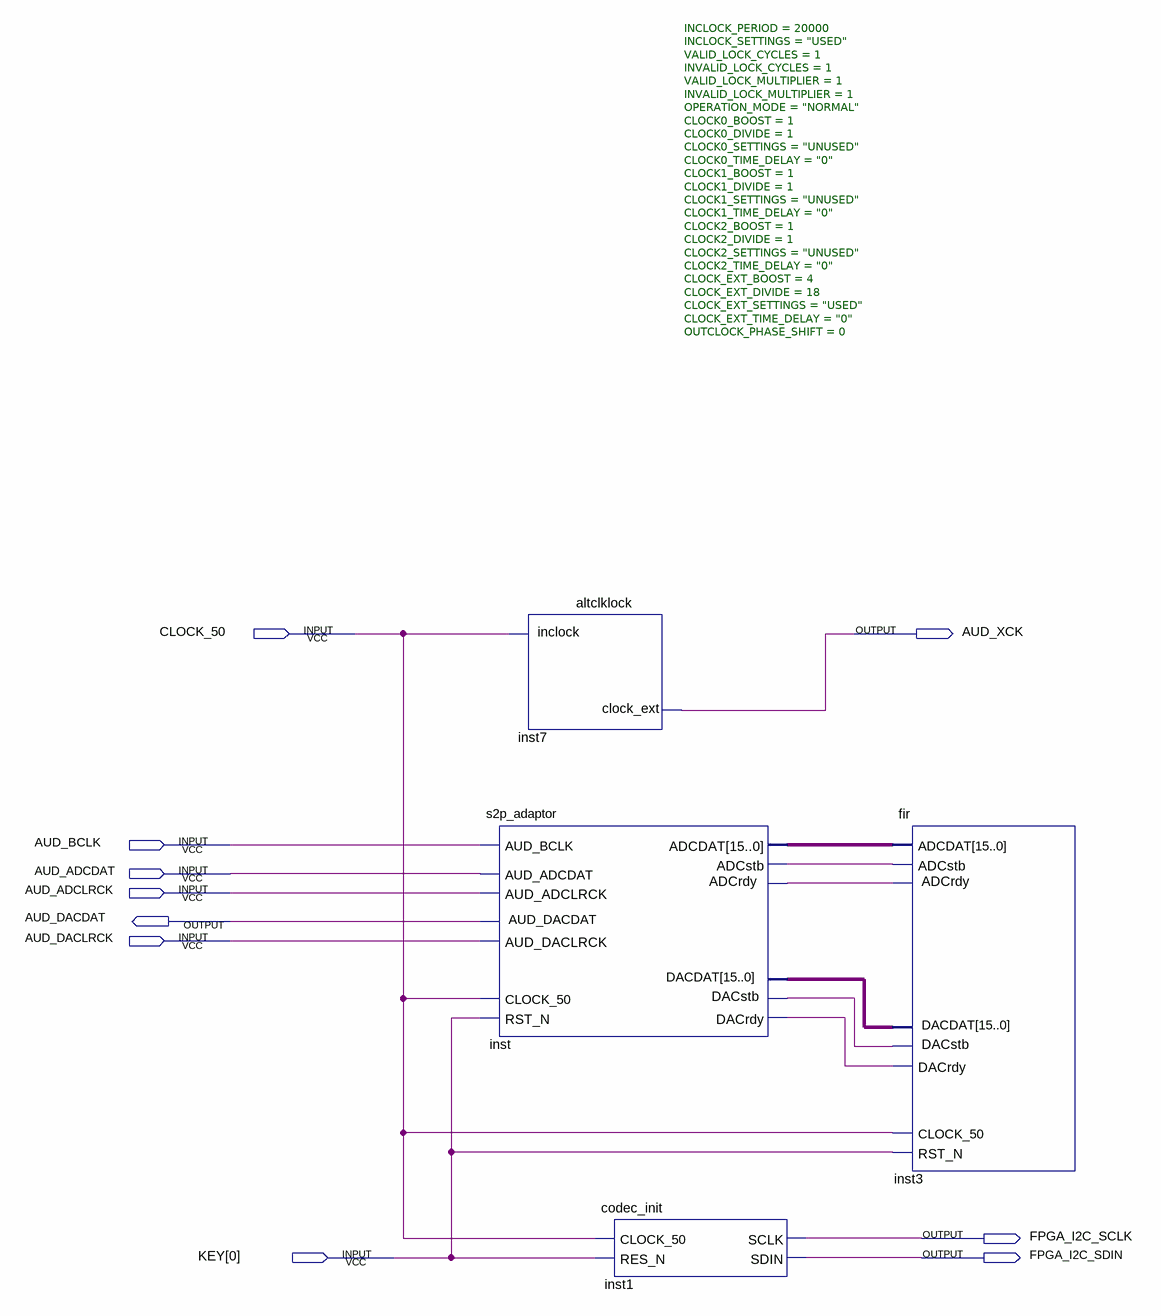
[diagram p0: schematic sheet]
// Quartus schematic audio_processor.bdf as structural Verilog: 4 symbols, 10 pins
module audio_processor (
  input  CLOCK_50,
  input  AUD_BCLK,
  input  AUD_ADCDAT,
  input  AUD_ADCLRCK,
  input  AUD_DACLRCK,
  input  [0:0] KEY,
  output AUD_XCK,
  output AUD_DACDAT,
  output FPGA_I2C_SCLK,
  output FPGA_I2C_SDIN
);

  wire inst3_adcrdy, inst3_dacstb, inst_adcstb, inst_dacrdy;
  wire [15:0] inst3_dacdat, inst_adcdat;

  altclklock #(.INCLOCK_PERIOD(20000), .INCLOCK_SETTINGS("USED"), .VALID_LOCK_CYCLES(1), .INVALID_LOCK_CYCLES(1), .VALID_LOCK_MULTIPLIER(1), .INVALID_LOCK_MULTIPLIER(1), .OPERATION_MODE("NORMAL"), .CLOCK0_BOOST(1), .CLOCK0_DIVIDE(1), .CLOCK0_SETTINGS("UNUSED"), .CLOCK0_TIME_DELAY("0"), .CLOCK1_BOOST(1), .CLOCK1_DIVIDE(1), .CLOCK1_SETTINGS("UNUSED"), .CLOCK1_TIME_DELAY("0"), .CLOCK2_BOOST(1), .CLOCK2_DIVIDE(1), .CLOCK2_SETTINGS("UNUSED"), .CLOCK2_TIME_DELAY("0"), .CLOCK_EXT_BOOST(4), .CLOCK_EXT_DIVIDE(18), .CLOCK_EXT_SETTINGS("USED"), .CLOCK_EXT_TIME_DELAY("0"), .OUTCLOCK_PHASE_SHIFT(0)) inst7 (
    .inclock(CLOCK_50), .clock_ext(AUD_XCK));
  s2p_adaptor inst (
    .DACDAT(inst3_dacdat), .ADCrdy(inst3_adcrdy), .DACstb(inst3_dacstb), .AUD_ADCDAT(AUD_ADCDAT),
    .AUD_ADCLRCK(AUD_ADCLRCK), .AUD_DACLRCK(AUD_DACLRCK), .AUD_BCLK(AUD_BCLK), .CLOCK_50(CLOCK_50),
    .RST_N(KEY[0]), .ADCDAT(inst_adcdat), .DACrdy(inst_dacrdy), .ADCstb(inst_adcstb), .AUD_DACDAT(AUD_DACDAT));
  codec_init inst1 (.CLOCK_50(CLOCK_50), .RES_N(KEY[0]), .SCLK(FPGA_I2C_SCLK), .SDIN(FPGA_I2C_SDIN));
  fir inst3 (
    .ADCDAT(inst_adcdat), .DACrdy(inst_dacrdy), .ADCstb(inst_adcstb), .CLOCK_50(CLOCK_50), .RST_N(KEY[0]),
    .DACDAT(inst3_dacdat), .ADCrdy(inst3_adcrdy), .DACstb(inst3_dacstb));
endmodule
